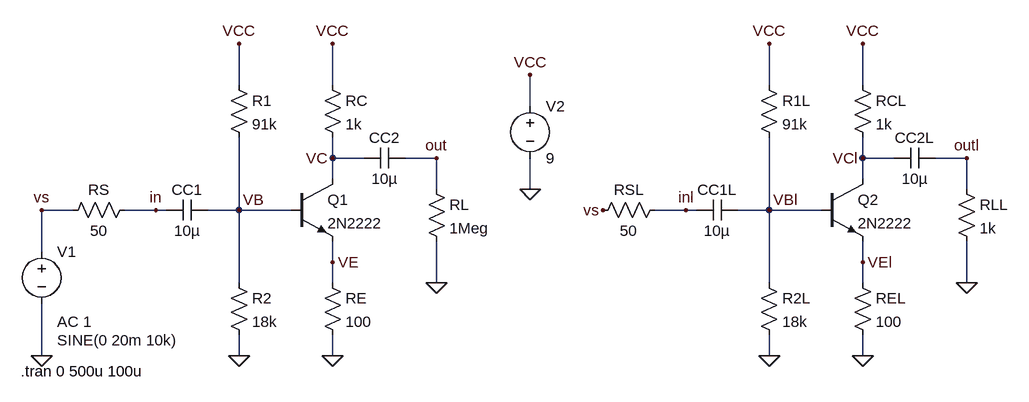
[diagram p0: schematic Perc-03-02-outputresistance.asc]
Perc-03-02-outputresistance.asc, the LTspice schematic file:
Version 4
SHEET 1 1336 680
WIRE 128 48 128 -16
WIRE 272 48 272 -16
WIRE 944 48 944 -16
WIRE 1088 48 1088 -16
WIRE 576 80 576 32
WIRE 272 160 272 128
WIRE 320 160 272 160
WIRE 432 160 384 160
WIRE 1088 160 1088 128
WIRE 1136 160 1088 160
WIRE 1248 160 1200 160
WIRE 272 192 272 160
WIRE 1088 192 1088 160
WIRE 432 208 432 160
WIRE 576 208 576 160
WIRE 1248 208 1248 160
WIRE -128 240 -176 240
WIRE 0 240 -48 240
WIRE 16 240 0 240
WIRE 128 240 128 128
WIRE 128 240 80 240
WIRE 208 240 128 240
WIRE 816 240 768 240
WIRE 832 240 816 240
WIRE 944 240 944 128
WIRE 944 240 896 240
WIRE 1024 240 944 240
WIRE -176 304 -176 240
WIRE 272 320 272 288
WIRE 1088 320 1088 288
WIRE 128 352 128 240
WIRE 272 352 272 320
WIRE 432 352 432 288
WIRE 944 352 944 240
WIRE 1088 352 1088 320
WIRE 1248 352 1248 288
WIRE -176 464 -176 384
WIRE 128 464 128 432
WIRE 272 464 272 432
WIRE 944 464 944 432
WIRE 1088 464 1088 432
FLAG 272 464 0
FLAG 128 464 0
FLAG 128 -16 VCC
FLAG 272 -16 VCC
FLAG 432 352 0
FLAG 576 208 0
FLAG 576 32 VCC
FLAG -176 464 0
FLAG 0 240 in
FLAG 432 160 out
FLAG 128 240 VB
FLAG 272 320 VE
FLAG 272 160 VC
FLAG 1088 464 0
FLAG 944 464 0
FLAG 944 -16 VCC
FLAG 1088 -16 VCC
FLAG 1248 352 0
FLAG 816 240 inl
FLAG 1248 160 outl
FLAG 944 240 VBl
FLAG 1088 320 VEl
FLAG 1088 160 VCl
FLAG -176 240 vs
FLAG 688 240 vs
SYMBOL npn 208 192 R0
SYMATTR InstName Q1
SYMATTR Value 2N2222
SYMBOL res 256 32 R0
SYMATTR InstName RC
SYMATTR Value 1k
SYMBOL res 112 32 R0
SYMATTR InstName R1
SYMATTR Value 91k
SYMBOL res 112 336 R0
SYMATTR InstName R2
SYMATTR Value 18k
SYMBOL res 256 336 R0
SYMATTR InstName RE
SYMATTR Value 100
SYMBOL cap 384 144 R90
WINDOW 0 0 32 VBottom 2
WINDOW 3 32 32 VTop 2
SYMATTR InstName CC2
SYMATTR Value 10µ
SYMBOL cap 80 224 R90
WINDOW 0 0 32 VBottom 2
WINDOW 3 32 32 VTop 2
SYMATTR InstName CC1
SYMATTR Value 10µ
SYMBOL res 416 192 R0
SYMATTR InstName RL
SYMATTR Value 1Meg
SYMBOL voltage -176 288 R0
WINDOW 3 24 152 Left 2
WINDOW 123 24 124 Left 2
WINDOW 39 0 0 Left 0
SYMATTR Value SINE(0 20m 10k)
SYMATTR Value2 AC 1
SYMATTR InstName V1
SYMBOL voltage 576 64 R0
SYMATTR InstName V2
SYMATTR Value 9
SYMBOL res -32 224 R90
WINDOW 0 0 56 VBottom 2
WINDOW 3 32 56 VTop 2
SYMATTR InstName RS
SYMATTR Value 50
SYMBOL npn 1024 192 R0
SYMATTR InstName Q2
SYMATTR Value 2N2222
SYMBOL res 1072 32 R0
SYMATTR InstName RCL
SYMATTR Value 1k
SYMBOL res 928 32 R0
SYMATTR InstName R1L
SYMATTR Value 91k
SYMBOL res 928 336 R0
SYMATTR InstName R2L
SYMATTR Value 18k
SYMBOL res 1072 336 R0
SYMATTR InstName REL
SYMATTR Value 100
SYMBOL cap 1200 144 R90
WINDOW 0 0 32 VBottom 2
WINDOW 3 32 32 VTop 2
SYMATTR InstName CC2L
SYMATTR Value 10µ
SYMBOL cap 896 224 R90
WINDOW 0 0 32 VBottom 2
WINDOW 3 32 32 VTop 2
SYMATTR InstName CC1L
SYMATTR Value 10µ
SYMBOL res 1232 192 R0
SYMATTR InstName RLL
SYMATTR Value 1k
SYMBOL res 784 224 R90
WINDOW 0 0 56 VBottom 2
WINDOW 3 32 56 VTop 2
SYMATTR InstName RSL
SYMATTR Value 50
TEXT -208 488 Left 2 !.tran 0 500u 100u

The netlist it stands for:
* Perc-03-02-outputresistance.asc
Q1 VC VB VE 0 2N2222
RC VCC VC 1k
R1 VCC VB 91k
R2 VB 0 18k
RE VE 0 100
CC2 out VC 10µ
CC1 VB in 10µ
RL out 0 1Meg
V1 vs 0 SINE(0 20m 10k) AC 1
V2 VCC 0 9
RS in vs 50
Q2 VCl VBl VEl 0 2N2222
RCL VCC VCl 1k
R1L VCC VBl 91k
R2L VBl 0 18k
REL VEl 0 100
CC2L outl VCl 10µ
CC1L VBl inl 10µ
RLL outl 0 1k
RSL inl vs 50
.model NPN NPN
.model PNP PNP
.lib standard.bjt
.tran 0 500u 100u
.backanno
.end